# Altium schematic sheet GTM_TorpedoModuleControlConnector.SchDoc
size A4
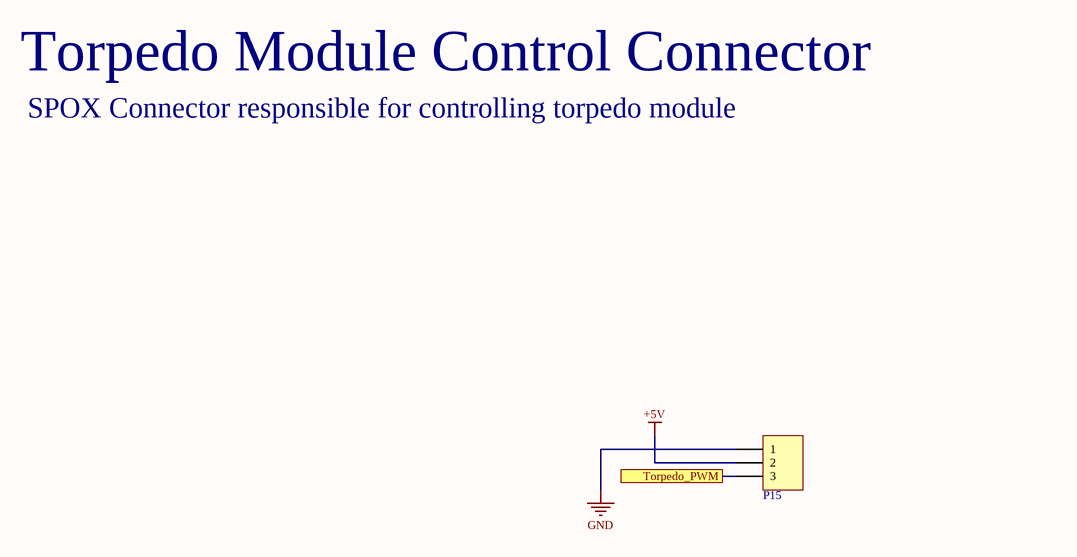
[diagram p0: GTM_TorpedoModuleControlConnector.SchDoc]

## Parts
P15  HDR1X3  [Molex SPOX Horizontal 3 Circuits]  (value not drawn)

## Ports
Torpedo_PWM

## Nets
+5V: P15.2
GND: P15.1
Torpedo_PWM: P15.3 ; port Torpedo_PWM

## Notes on the sheet
- Torpedo Module Control Connector
- SPOX Connector responsible for controlling torpedo module
- Project
- Rev.
- Title
- Drawn by
- Date
- Sheet
- of
- Checked by

## Library data of the parts
P15 = HDR1X3: Header, 3-Pin; LatestRevisionDate: 17-Jul-2002; LatestRevisionNote: Re-released for DXP Platform.; Publisher: Altium Limited